# EAGLE design ACSN v1 (EAGLE 9.6.2)
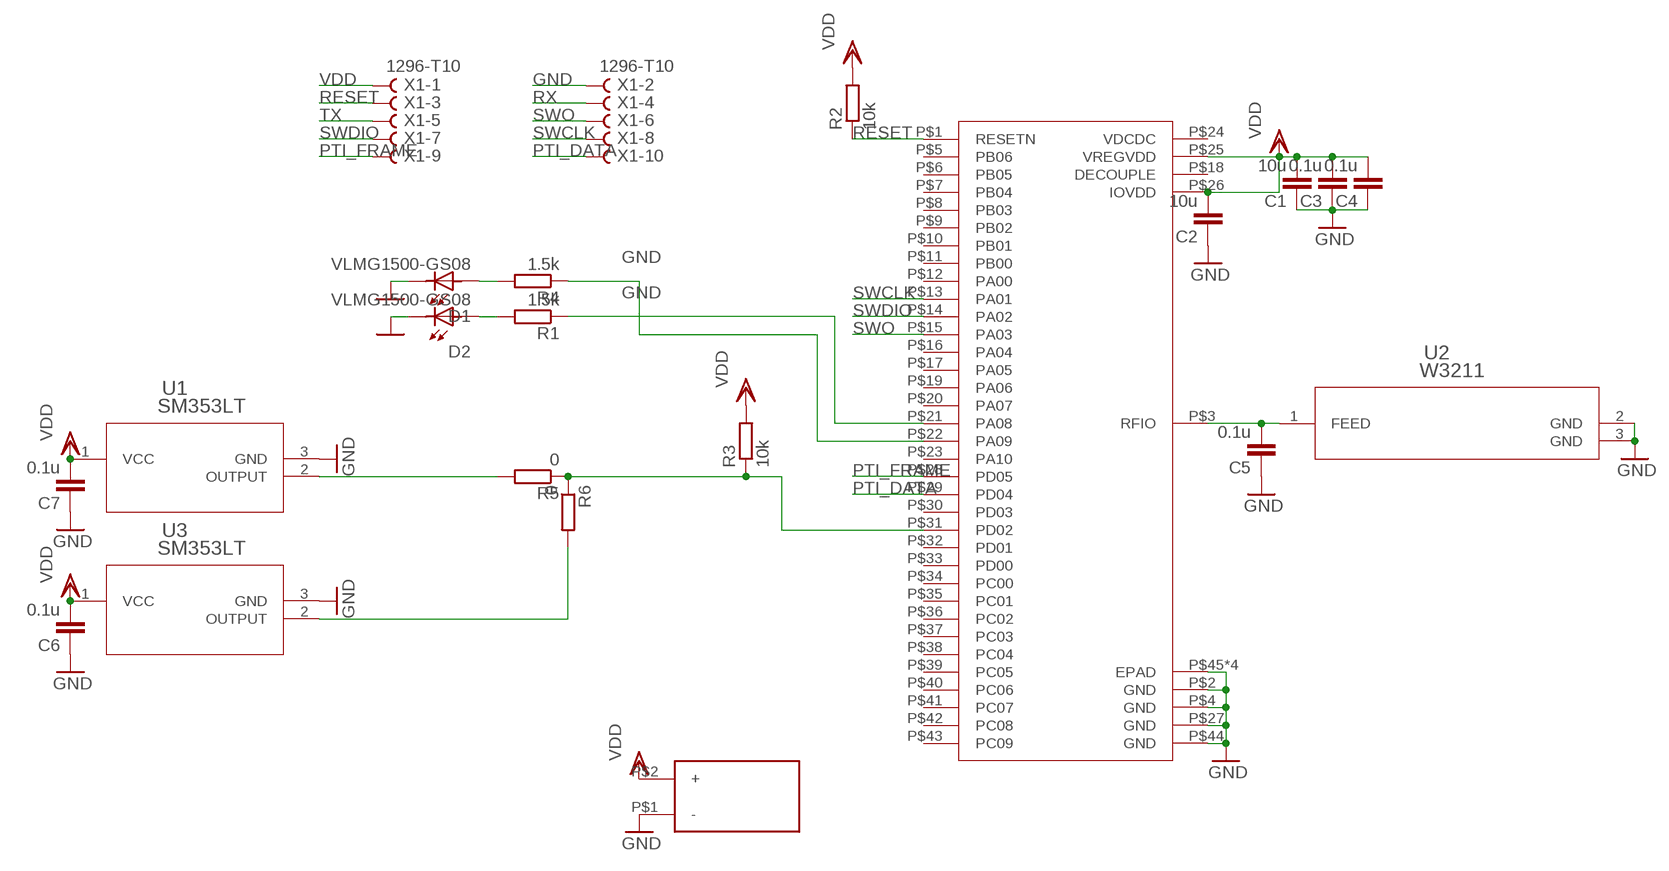
[diagram p0: schematic, sheet 1]

## Parts
C1  10u  CC0603R  [C0603R]
C2  10u  CC0603R  [C0603R]
C3  0.1u  CC0402  [C0402]
C4  0.1u  CC0402  [C0402]
C5  0.1u  CC0402  [C0402]
C6  0.1u  CC0402  [C0402]
C7  0.1u  CC0402  [C0402]
D1  VLMG1500-GS08  [LEDC1005X35N]
D2  VLMG1500-GS08  [LEDC1005X35N]
R1  1.5k  RR0402  [R0402]
R2  10k  RR0402  [R0402]
R3  10k  RR0402  [R0402]
R4  1.5k  RR0402  [R0402]
R5  0  RR0402  [R0402]
R6  0  RR0402  [R0402]
U1  SM353LT  [SM353LT_HNW]
U2  W3211  [CHIP_3211_PUL]
U3  SM353LT  [SM353LT_HNW]
U$1  ZGM230S  [ZGM230S]
U$2  BS-24R  [BS-24]
X1  1296-T10  [1296-10]

## Nets
GND: C1.1 C2.1 C3.1 C4.1 C5.1 C6.1 C7.1 D1.2 D2.2 U1.3(GND) U2.2(GND) U2.3(GND) U3.3(GND) U$1.P$2(GND) U$1.P$4(GND) U$1.P$27(GND) U$1.P$44(GND) U$1.P$45(EPAD) U$1.P$46(EPAD) U$1.P$47(EPAD) U$1.P$48(EPAD) U$2.P$1(-) X1.2
N$1: D2.1 R1.2
N$2: R1.1 U$1.P$21(PA08)
N$3: R4.1 U$1.P$22(PA09)
N$5: C5.2 U2.1(FEED) U$1.P$3(RFIO)
N$6: R3.1 R5.1 R6.1 U$1.P$31(PD02)
N$7: D1.1 R4.2
N$8: R5.2 U1.2(OUTPUT)
N$9: R6.2 U3.2(OUTPUT)
PTI_DATA: U$1.P$29(PD04) X1.10
PTI_FRAME: U$1.P$28(PD05) X1.9
RESET: R2.1 U$1.P$1(RESETN) X1.3
RX: X1.4
SWCLK: U$1.P$13(PA01) X1.8
SWDIO: U$1.P$14(PA02) X1.7
SWO: U$1.P$15(PA03) X1.6
TX: X1.5
VDD: C1.2 C2.2 C3.2 C4.2 C6.2 C7.2 R2.2 R3.2 U1.1(VCC) U3.1(VCC) U$1.P$25(VREGVDD) U$1.P$26(IOVDD) U$2.P$2(+) X1.1
Unconnected: U$1.P$5(PB06) U$1.P$6(PB05) U$1.P$7(PB04) U$1.P$8(PB03) U$1.P$9(PB02) U$1.P$10(PB01) U$1.P$11(PB00) U$1.P$12(PA00) U$1.P$16(PA04) U$1.P$17(PA05) U$1.P$18(DECOUPLE) U$1.P$19(PA06) U$1.P$20(PA07) U$1.P$23(PA10) U$1.P$24(VDCDC) U$1.P$30(PD03) U$1.P$32(PD01) U$1.P$33(PD00) U$1.P$34(PC00) U$1.P$35(PC01) U$1.P$36(PC02) U$1.P$37(PC03) U$1.P$38(PC04) U$1.P$39(PC05) U$1.P$40(PC06) U$1.P$41(PC07) U$1.P$42(PC08) U$1.P$43(PC09)

## Library data of the parts
C1 C2 = eagle-ltspice:C: CAPACITOR, European symbol
C3-C7 = eagle-ltspice:C: CAPACITOR, European symbol; SPICEMODEL: NONE; SPICEPREFIX: C
D1 D2 = VLMG1500-GS08:VLMG1500-GS08: 0402 GREEN 571nm 35MCD 65° Rectangle with Flat Top SMT LED; AVAILABILITY: Unavailable; DESCRIPTION: 0402 GREEN 571nm 35MCD 65° Rectangle with Flat Top SMT LED; MF: Vishay; MP: VLMG1500-GS08; PACKAGE: 0402 Vishay; PRICE: None
R1-R6 = eagle-ltspice:R: RESISTOR, European symbol; SPICEMODEL: NONE; SPICEPREFIX: R
U1 U3 = SM353LT:SM353LT; COPYRIGHT: Copyright (C) 2022 Ultra Librarian. All rights reserved.; MANUFACTURER_PART_NUMBER: SM353LT; MFR_NAME: Honeywell
U2 = W3211:W3211; COPYRIGHT: Copyright (C) 2022 Ultra Librarian. All rights reserved.; MANUFACTURER_PART_NUMBER: W3211; MFR_NAME: Pulse Electronics Corporation
U$1 = ZGM230S:ZGM230S
U$2 = BS-24:BS-24R
X1 = con-leotronics:1296-T10: 1.27mm SINGLE ROW FEMALE SOCKET Source: http://www.leotronics.co.uk/Conexcon/Data%20Sheets/sec.%20A/1296ing.pdf; OC_FARNELL: unknown; OC_NEWARK: unknown

## Board
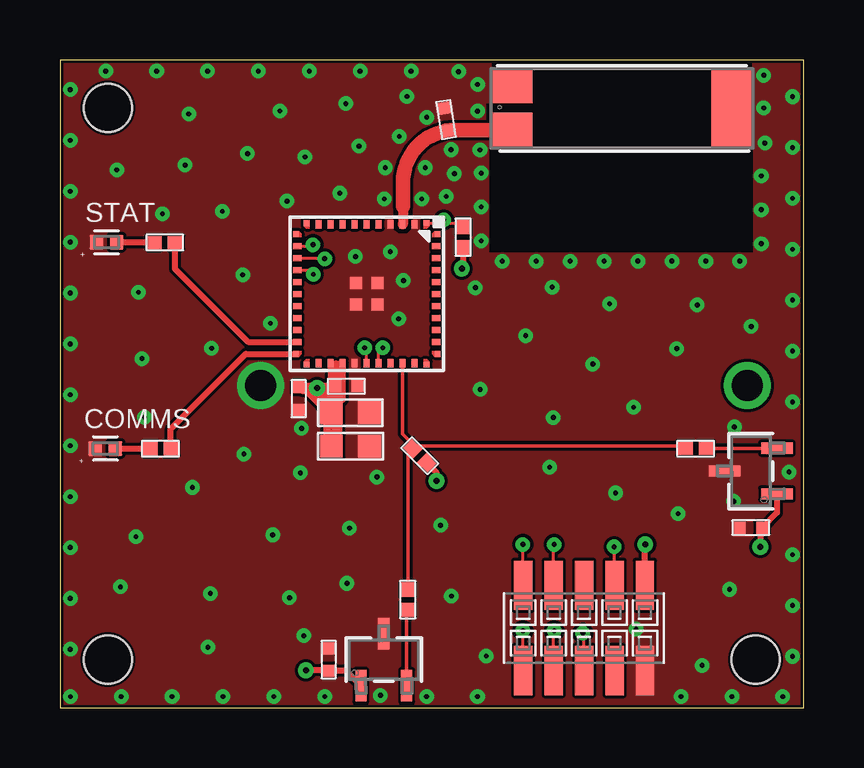
[diagram p1: board, top side]
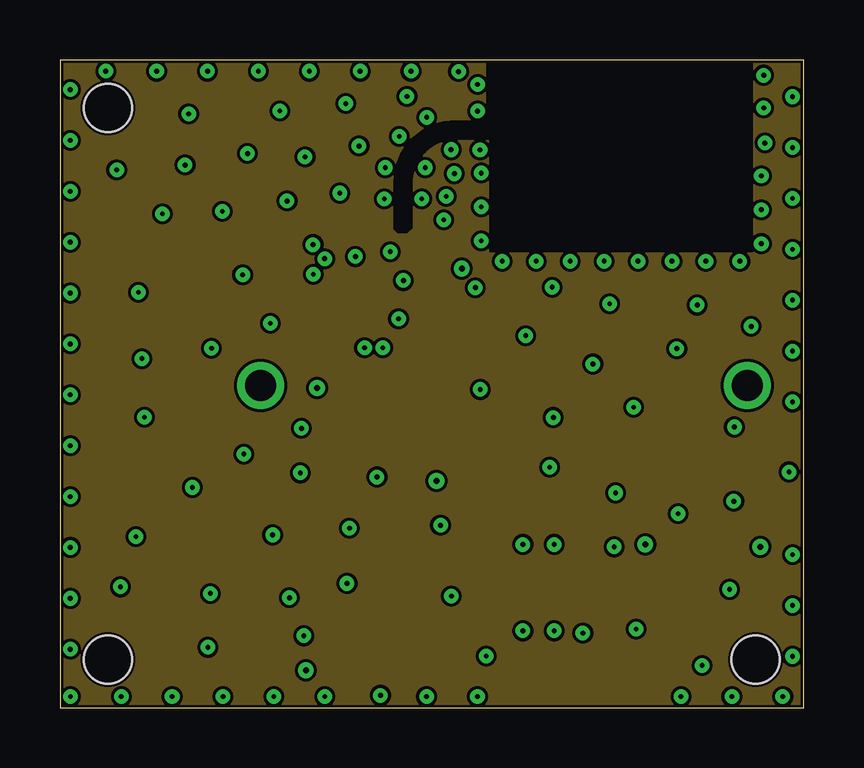
[diagram p2: board, inner layer Route2]
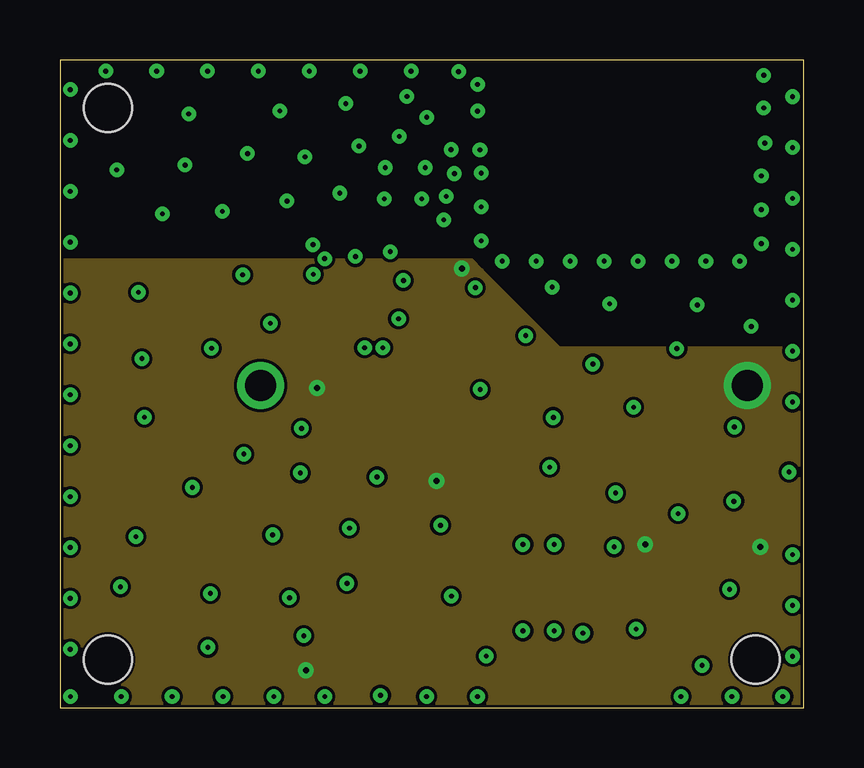
[diagram p3: board, inner layer Route15]
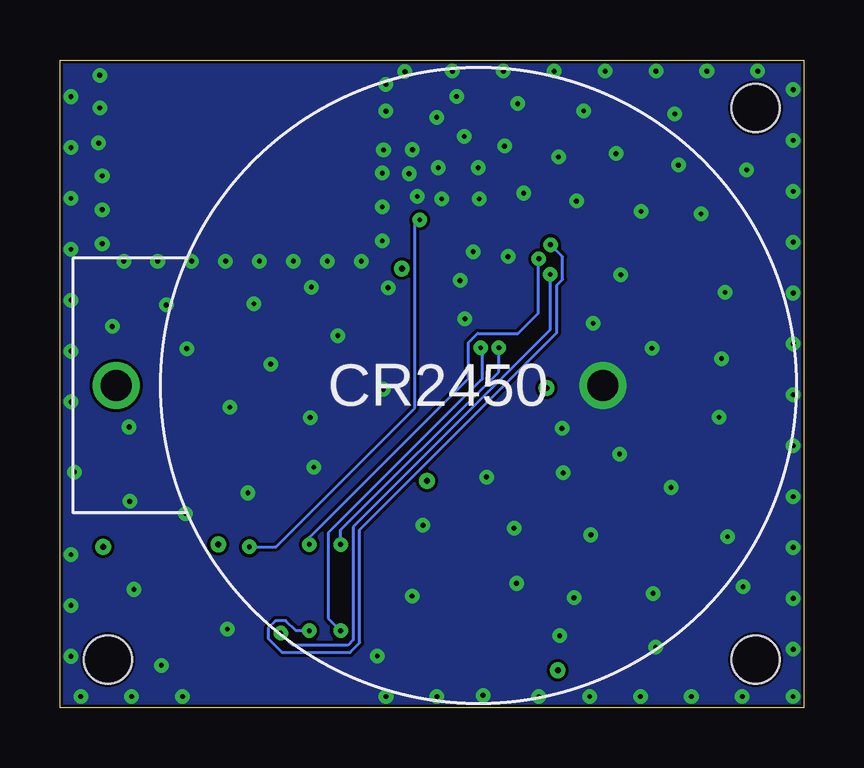
[diagram p4: board, bottom side, seen from below]

Size 31 x 27 mm. Coordinates in mm from the lower left corner, seen from the top.
Outline: 0,0 31,0 31,27 0,27 0,0
Copper layers (1+2*15+16): Top 0.035mm / dielectric 0.51mm / Route2 0.035mm / dielectric 0.15mm / Route15 0.035mm / dielectric 0.2mm / Bottom 0.035mm
Design rules "default *": minimum track width 5mil, minimum drill 0.2mm, track to track 5mil, track to pad 6mil, pad to pad 6mil, via to via 6mil, smd to smd 6mil, copper to edge 5mil, drill to drill 6mil, minimum pad ring 10mil, minimum via ring 8mil, stop-mask expansion 0mil, vias tented up to drill 40mil, thermal gap 0mil
Holes 2 mm at 2,2 2,25 29,2
tRestrict: 14 lines

### Footprints (pad centres in the part's own frame; a part is rotated, then mirrored left to right if it is on the bottom)
C0603R = smd 0.95 x 0.95: 1 -0.85,0; 2 0.75,0
C0402 = smd 0.5 x 0.5: 1 -0.475,0; 2 0.475,0
LEDC1005X35N = smd 0.59 x 0.61: 1 -0.415,0; 2 0.415,0
R0402 = smd 0.6 x 0.55: 1 -0.425,0; 2 0.425,0
SM353LT_HNW = smd 0.466 x 1.31: 1 -0.953,-1.092; 2 0.953,-1.092; 3 0,1.092
CHIP_3211_PUL = smd 1.7 x 1.45: 1 -4.277,-0.9; 3 -4.277,0.95 | smd 1.7 x 3.2: 2 4.877,0
ZGM230S = smd 0.24 x 0.25: P$1 0.045,0; P$11 0.05,-5; P$23 5.955,-5; P$33 5.955,0 | smd 0.35 x 0.25: P$2 0.1,-0.5; P$3 0.1,-1; P$4 0.1,-1.5; P$5 0.1,-2; P$6 0.1,-2.5; P$7 0.1,-3; P$8 0.1,-3.5; P$9 0.1,-4; P$10 0.1,-4.5; P$24 5.9,-4.5; P$25 5.9,-4; P$26 5.9,-3.5; P$27 5.9,-3; P$28 5.9,-2.5; P$29 5.9,-2; P$30 5.9,-1.5; P$31 5.9,-1; P$32 5.9,-0.5 | smd 0.25 x 0.24: P$12 0.5,-5.455; P$22 5.5,-5.455; P$34 5.5,0.455; P$44 0.5,0.455 | smd 0.25 x 0.35: P$13 1,-5.4; P$14 1.5,-5.4; P$15 2,-5.4; P$16 2.5,-5.4; P$17 3,-5.4; P$18 3.5,-5.4; P$19 4,-5.4; P$20 4.5,-5.4; P$21 5,-5.4; P$35 5,0.4; P$36 4.5,0.4; P$37 4,0.4; P$38 3.5,0.4; P$39 3,0.4; P$40 2.5,0.4; P$41 2,0.4; P$42 1.5,0.4; P$43 1,0.4 | smd 0.5 x 0.5: P$45 2.55,-2.95; P$46 3.45,-2.95; P$47 3.45,-2.05; P$48 2.55,-2.05
BS-24 = drill 1.3: P$1 0,0; P$2 20.3,0
1296-10 = smd 0.76 x 2.05: 1 -2.54,-1.78; 2 -2.54,1.78; 3 -1.27,-1.78; 4 -1.27,1.78; 5 0,-1.78; 6 0,1.78; 7 1.27,-1.78; 8 1.27,1.78; 9 2.54,-1.78; 10 2.54,1.78

### Placement (x,y rotation side)
C1  12.05,12.3 180 top
C2  12.06,10.9 180 top
C3  28.8,7.5 0 top
C4  11.94,13.4 180 top
C5  16.1,24.52 278.8 top
C6  11.2,2 270 top
C7  9.95,12.88 90 top
D1  1.89,10.8 180 top
D2  1.94,19.4 180 top
R1  4.37,19.39 180 top
R2  16.81,19.61 270 top
R3  15,10.5 315 top
R4  4.19,10.79 180 top
R5  26.5,10.8 0 top
R6  14.5,4.5 270 top
U1  28.8,9.86 90 top
U2  23.13,24.98 0 top
U3  13.5,2 0 top
U$1  15.29,20.25 270 top
U$2  8.36,13.43 180 bottom
X1  21.85,3.32 180 top

### Tracks (layer width: path | path; a pad name or v marks a point on that pad's centre or on a via)
GND  (via drill 0.2)
  other vias: 0.43,2.43 0.43,4.55 0.43,6.67 0.43,8.8 0.43,10.92 0.43,13.04 0.43,15.16 0.43,17.28 0.43,19.4 0.43,21.52 0.43,23.64 0.43,25.77 14.64,26.53 12.52,26.53 10.39,26.53 8.27,26.53 6.15,26.53 4.03,26.53 1.91,26.53 17.56,19.46 16.62,26.52 30.54,25.47 30.54,23.35 30.54,21.23 30.54,19.11 30.54,16.98 30.54,14.86 30.54,12.74 30.39,9.82 28.09,8.6 30.54,6.38 30.54,4.26 30.54,2.13 30.13,0.46 28.01,0.46 25.89,0.46 17.41,0.46 15.28,0.46 13.36,0.51 11.04,0.46 8.92,0.46 6.8,0.46 4.68,0.46 2.56,0.46 0.43,0.46 17.56,20.87 17.56,22.29 17.51,23.25 17.41,24.87 17.41,25.98 16.31,23.26 15.29,24.61 15.23,22.51 13.56,22.51 14.15,23.81 15.08,21.21 13.52,21.21 16.11,21.31 16.44,22.26 28.34,18.61 26.93,18.61 25.51,18.61 24.1,18.61 22.68,18.61 21.27,18.61 19.86,18.61 18.44,18.61 29.34,26.36 29.34,25 29.39,23.53 29.24,22.17 29.24,20.76 29.24,19.34 2.37,22.42 5.37,24.75 14.47,25.48 17.32,17.5 11.92,25.18 12.47,23.41 7.62,18.04 8.77,16.02 3.42,14.55 20.52,17.53 19.42,15.51 26.57,16.78 25.72,14.96 28.82,15.89 22.22,14.32 23.17,8.95 9.57,4.58 5.22,22.62 7.82,23.1 9.17,24.88 10.22,22.95 4.27,20.58 3.27,17.31 6.77,20.69 9.47,21.12 11.67,21.45 6.32,14.98 3.52,12.11 22.92,16.83 17.52,13.26 20.57,12.09 23.92,12.52 28.12,11.7 3.17,7.13 10.02,9.78 13.22,9.61 10.07,11.64 7.67,10.57 16.32,4.65 5.52,9.18 6.27,4.76 2.52,5.03 6.17,2.51 10.17,2.99 20.42,10.02 8.87,7.2 11.97,5.18 15.87,7.6 27.92,4.93 26.77,1.76 25.77,8.08 24.02,3.27 17.77,2.15 12.07,7.48 14.32,17.8 14.12,16.2 13.77,19 12.32,18.8
  pour Top: 0,27 17.95,27 17.95,26.65 17.95,26.57 19.65,26.57 19.65,25.25 19.6,25.25 17.73,25.25 17.73,24.52 16.45,24.52 arc90 13.85,21.93 13.85,21.9 13.85,19.95 14.03,19.77 14.07,19.73 14.47,19.73 14.72,19.98 14.75,20 14.75,20.93 14.75,21.85 arc-90 16.52,23.62 17.85,23.62 17.85,18.95 17.85,18.93 18.02,18.93 28.95,18.93 28.95,23.38 28.9,23.43 27.23,23.43 27.23,26.52 28.9,26.52 28.9,26.95 30.98,26.95 30.98,0.05 0.05,0.05 0.05,26.95
  pour Bottom: 0.05,27.05 31,27.05 31,-0.1 0.05,-0.1
GND1
  pour Route2: 0,27 17.73,27 17.73,24.52 16.45,24.52 arc90 13.85,21.93 13.85,19.95 14.07,19.73 14.47,19.73 14.75,20 14.75,21.85 arc-90 16.52,23.62 17.85,23.62 17.85,18.93 28.95,18.93 28.95,26.95 30.98,26.95 30.98,0.05 0.05,0.05 0.05,26.95
N$1
  Top 0.254: R1.2 2.37,19.39 D2.1
N$2
  Top 0.254: U$1.P$21 7.83,15.25 4.79,18.29 R1.1
N$3
  Top 0.254: R4.1 4.62,11.62 7.75,14.75 U$1.P$22
N$5
  Top 0.127: C5.2 16.2,24.08 16.48,24.08
  Top 0.406: 14.3,20.9 U$1.P$3
  Top 0.6: U2.1 16.48,24.08 arc90 14.3,21.9 14.3,20.9
N$6
  Top 0.152: R5.1 25.98,10.9 14.8,10.9 R3.1 | R6.1 14.5,10.6 R3.1 | U$1.P$31 14.29,11.41 14.8,10.9 R3.1
N$7
  Top 0.254: D1.1 3.75,10.8 R4.2
N$8
  Top 0.152: U1.2 R5.2
N$9
  Top 0.152: U3.2 14.45,4.03 R6.2
PTI_DATA  (via drill 0.2)
  Top 0.127: X1.10 v19.31,3.19 v19.3,3.2 | U$1.P$29 13.29,14.83 v13.46,15
  Bottom 0.127: v13.46,15 13.4,14.94 13.4,13.7 19.82,7.28 19.82,3.72 v19.3,3.2
PTI_FRAME  (via drill 0.2)
  Top 0.127: X1.9 v19.31,6.79 v19.3,6.8 | U$1.P$28 12.79,14.91 v12.7,15
  Bottom 0.127: v19.3,6.8 19.3,7.4 12.7,14 v12.7,15
RESET  (via drill 0.2)
  Top 0.127: X1.3 23.12,6.68 v23.1,6.7 | U$1.P$1 16.1,20.2 | 16.1,20.2 16.64,20.2 R2.1 | 16.1,20.2 16,20.3 v16,20.33
  Bottom 0.127: v23.1,6.7 22,6.7 16.2,12.5 16.2,20.13 v16,20.33
SWCLK  (via drill 0.2)
  Top 0.127: X1.8 20.58,3.18 v20.6,3.2 | U$1.P$13 10.5,19.25 v10.55,19.3
  Bottom 0.127: v20.6,3.2 21.17,3.2 21.59,3.62 22.02,3.62 22.32,3.31 22.32,2.88 21.73,2.3 18.91,2.3 18.5,2.7 18.5,7.41 10.28,15.63 10.28,17.61 10.04,17.85 10.04,18.79 v10.55,19.3
SWDIO  (via drill 0.2)
  Top 0.127: X1.7 20.58,6.78 v20.6,6.8 | U$1.P$14 11,18.75 v11.04,18.71
  Bottom 0.127: v20.6,6.8 20.6,7.1 13.98,13.72 13.98,15.21 13.59,15.6 11.9,15.6 11.08,16.42 11.08,18.67 v11.04,18.71
SWO  (via drill 0.2)
  Top 0.127: X1.6 21.85,3.05 v21.8,3.1 | U$1.P$15 10.38,18.25 v10.56,18.06
  Bottom 0.127: v10.56,18.06 10.56,15.74 18.78,7.52 18.78,2.82 19,2.6 21.3,2.6 v21.8,3.1
VDD  (via drill 0.25)
  Top 0.254: U3.1 11.93,1.52 C6.2 11.18,1.55 v10.25,1.55 | U1.1 29.89,8.12 C3.2 29.2,7.42 v29.2,6.7 | X1.1 v24.39,6.79 v24.4,6.8 | 11.5,14.35 U$1.P$25 11.29,13.57 C4.2 | 11.5,14.35 U$1.P$26 11.79,14.06 | 11.58,13.52 11.79,13.72 | 11.58,13.52 C4.2 | 11.5,14.15 11.5,13.6 11.58,13.52 | 11.5,14.15 11.5,14.35 | 11.5,14.35 11.79,14.06 | 11.79,14.06 11.79,13.72 | 11.5,14.15 11.68,13.97 | 11.68,13.97 11.79,13.86 11.79,13.8 | C4.2 11.46,13.77 11.68,13.97 | C4.2 11.46,13.05 | 11.46,13.05 11.46,12.5 | 11.46,12.5 11.46,12.46 11.35,12.35 | 11.35,12.35 C1.2 11.3,12.66 11.79,13.15 | C4.2 11.25,13.4 | 11.25,13.4 10.8,13.4 | 10.8,13.4 9.99,13.4 C7.2 10.13,13.18 10.28,13.18 | 10.28,13.18 10.7,12.75 | 10.7,12.75 10.98,12.48 | 10.98,12.48 11.11,12.35 | 11.11,12.35 11.35,12.35 | 11.46,13.05 11.11,12.69 | 11.11,12.69 10.98,12.56 10.98,12.48 | 10.7,12.75 10.7,12.85 10.82,12.97 | 11.25,13.4 11.03,13.18 | 11.03,13.18 10.95,13.1 | 10.95,13.1 10.82,12.97 | C4.2 11.04,12.97 10.82,12.97 | 11.11,12.69 10.82,12.97 | 10.95,13.1 v10.72,13.33 | v10.72,13.33 10.47,13.33 10.62,13.18 | 11.11,11.65 11.11,11.11 C2.2 11.31,11.11 11.65,11.45 | 11.11,11.65 11.11,11.85 | 11.11,11.85 11.11,12.35 | 11.65,11.45 11.65,11.65 | 11.65,11.65 11.65,12.05 11.35,12.35 | 11.65,11.65 11.45,11.85 11.25,11.85 | 11.25,11.85 11.11,11.85 | 11.11,11.65 11.3,11.45 11.65,11.45 | 11.65,11.45 11.25,11.85 | 10.82,12.97 10.62,13.18 | 10.62,13.18 10.28,13.18 | 10.8,13.4 11.03,13.18 | 11.79,13.72 11.79,13.15 | 11.79,13.15 11.79,12.82 11.46,12.5 | C4.2 11.39,13.33 v10.72,13.33 | R2.2 16.81,18.36 v16.75,18.3 | R3.2 15.7,9.8 v15.7,9.45
  pour Route15: 30.9,15 20.85,15 17.6,18.25 17.2,18.65 16.2,18.65 0.05,18.65 0.05,0 31,0 31.05,0.05 31.05,14.85

### Text on the board
tPlace: STAT | COMMS
bPlace: CR2450
tStop: ACSN | v1.0